# Altium project FPGA3 Panel.PrjPCB
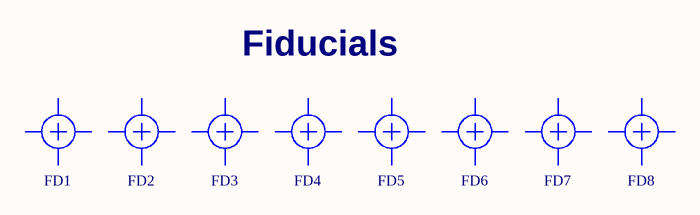
[diagram p0: FPGA3 Panel.SchDoc]
1 sheet, 8 parts. Net scope: flat (ports and power ports of the same name join across sheets).
Board file: FPGA3 Panel.PcbDoc

## Sheet FPGA3 Panel.SchDoc: IEEE-1394/Ethernet FPGA Controller
size 381 x 254 mm; Revision: 3.1; SheetNumber: 1; SheetTotal: 1; PageSetup: Record=PageOptions|CenterHorizontal=True|CenterVertical=True|PrintScale=1.08|XCorrection=1.00|YCorrection=1.00|PrintKind=1|BorderSize=5000000|LeftOffset=0|BottomOffset=0|Orientation=2|PaperLength=1000|PaperWidth=1000|Scale=100|PaperSource=7|PrintQuality=600|MediaType=1|DitherType=10|PrintScaleMode=1|PaperKind=Ledger|PaperIndex=3

### Parts
FD1  FD  [FD]  (value not drawn)
FD2  FD  [FD]  (value not drawn)
FD3  FD  [FD]  (value not drawn)
FD4  FD  [FD]  (value not drawn)
FD5  FD  [FD]  (value not drawn)
FD6  FD  [FD]  (value not drawn)
FD7  FD  [FD]  (value not drawn)
FD8  FD  [FD]  (value not drawn)

### Notes on the sheet
- Fiducials
- 1
- 2
- 3
- 4
- 5
- A
- B
- C
- Drawing Title:
- D
- E
- Sheet:
- Rev:
- F
- Title:
- Part No:
- Print Date:
- File Name:
- Sheet
- of